# EAGLE design PUCY_E3_wzor (EAGLE 5.07)
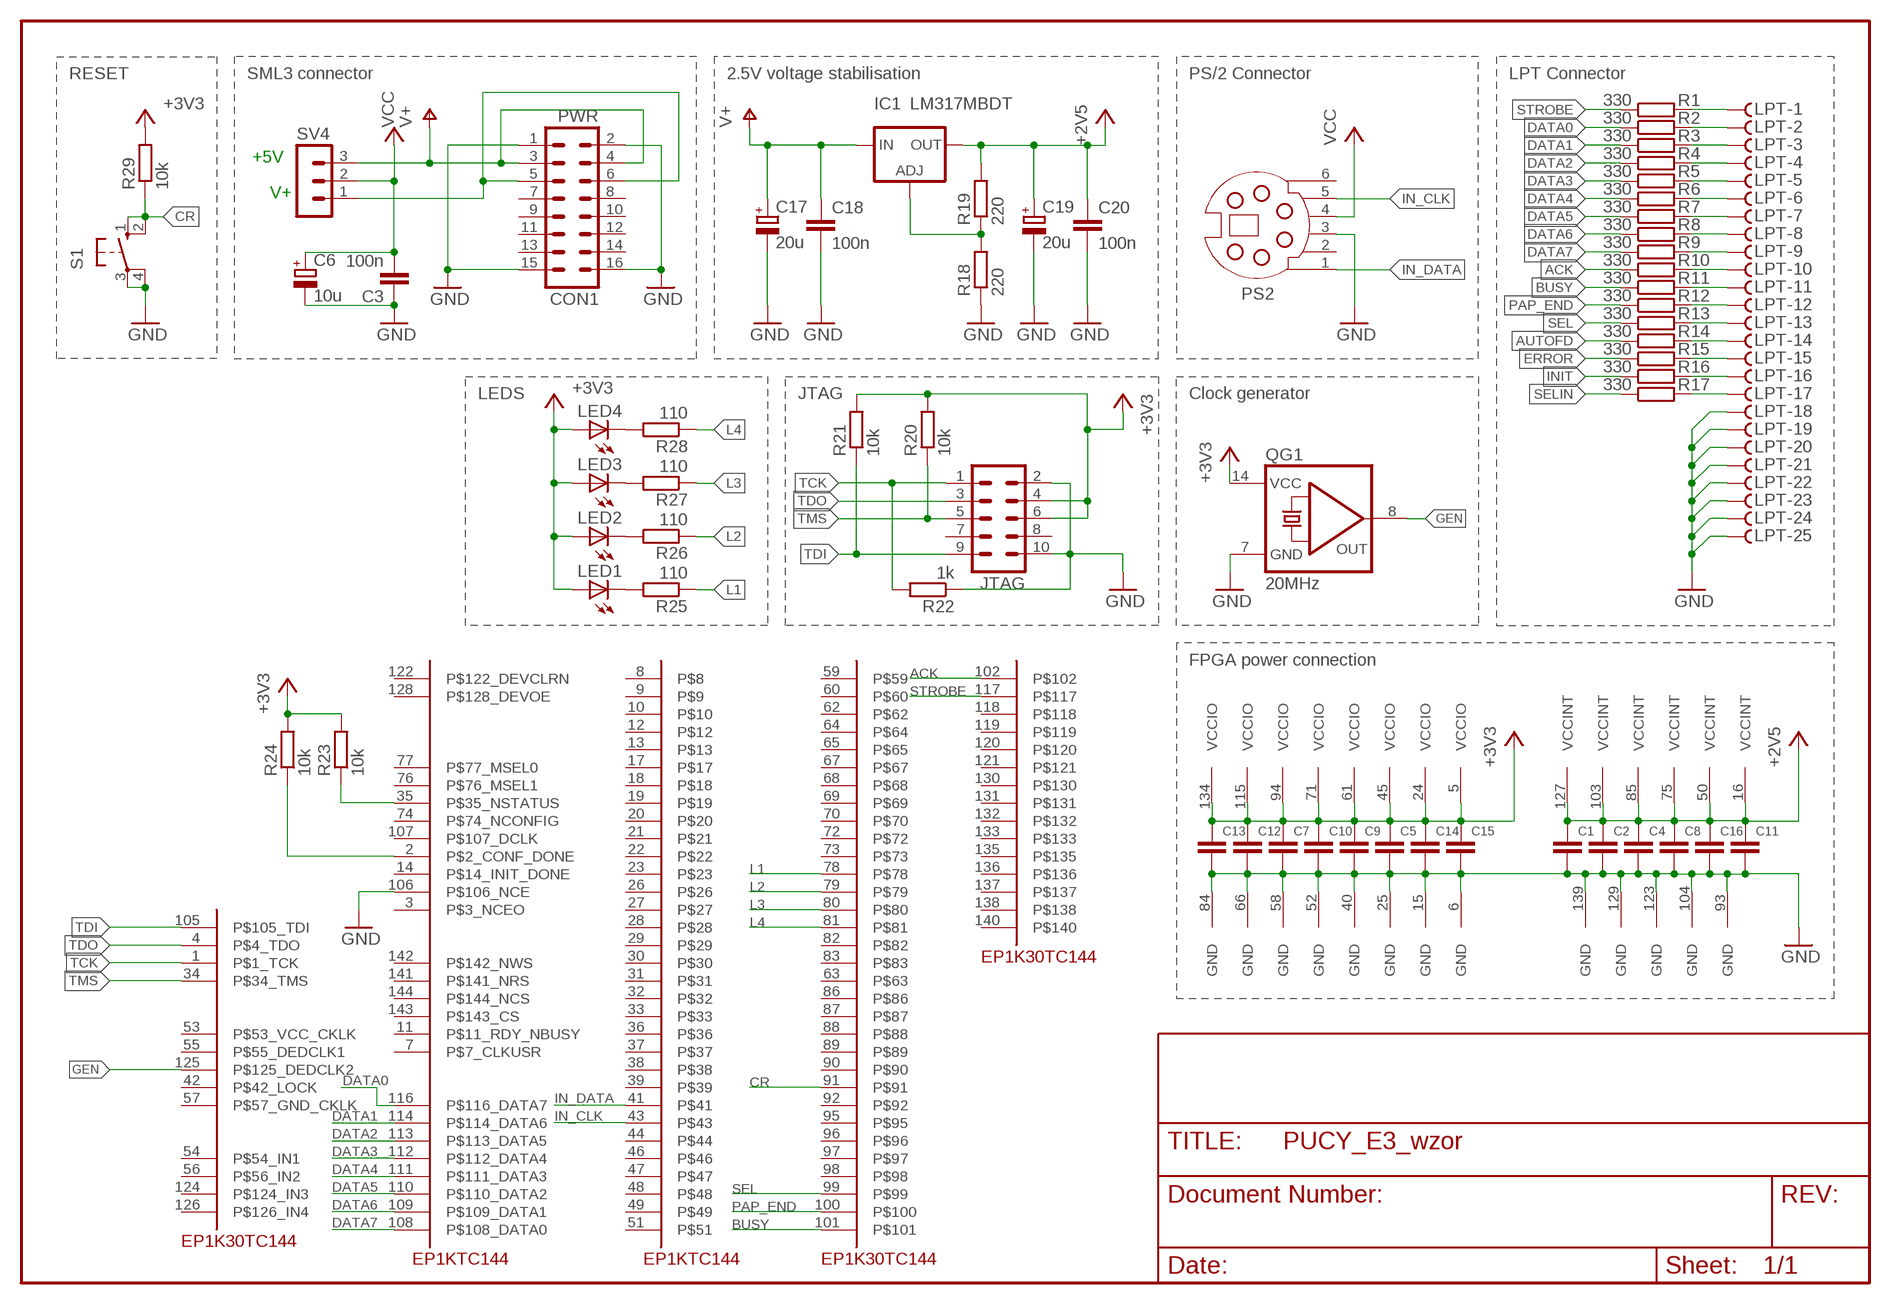
[diagram p0: schematic, sheet 1]

## Parts
C1  C-EUC0805  [C0805]
C2  C-EUC0805  [C0805]
C3  100n  C-EUC0805  [C0805]
C4  C-EUC0805  [C0805]
C5  C-EUC0805  [C0805]
C6  10u  CPOL-EUB/3528-21W  [B/3528-21W]
C7  C-EUC0805  [C0805]
C8  C-EUC0805  [C0805]
C9  C-EUC0805  [C0805]
C10  C-EUC0805  [C0805]
C11  C-EUC0805  [C0805]
C12  C-EUC0805  [C0805]
C13  C-EUC0805  [C0805]
C14  C-EUC0805  [C0805]
C15  C-EUC0805  [C0805]
C16  C-EUC0805  [C0805]
C17  20u  CPOL-EUB/3528-21W  [B/3528-21W]
C18  100n  C-EUC0805  [C0805]
C19  20u  CPOL-EUB/3528-21W  [B/3528-21W]
C20  100n  C-EUC0805  [C0805]
CON1  PWR  ML16  [ML16]
IC1  LM317MBDT  [DPACK]
JTAG  ML10  [ML10]
LED1  LEDCHIPLED_1206  [CHIPLED_1206]
LED2  LEDCHIPLED_1206  [CHIPLED_1206]
LED3  LEDCHIPLED_1206  [CHIPLED_1206]
LED4  LEDCHIPLED_1206  [CHIPLED_1206]
LPT  F25HPS  [F25HP]
PS2  MDSSV-BC06  [SSV-BC06]
QG1  20MHz  QG5860  [DIL14S]
R1  330  R-EU_R0805  [R0805]
R2  330  R-EU_R0805  [R0805]
R3  330  R-EU_R0805  [R0805]
R4  330  R-EU_R0805  [R0805]
R5  330  R-EU_R0805  [R0805]
R6  330  R-EU_R0805  [R0805]
R7  330  R-EU_R0805  [R0805]
R8  330  R-EU_R0805  [R0805]
R9  330  R-EU_R0805  [R0805]
R10  330  R-EU_R0805  [R0805]
R11  330  R-EU_R0805  [R0805]
R12  330  R-EU_R0805  [R0805]
R13  330  R-EU_R0805  [R0805]
R14  330  R-EU_R0805  [R0805]
R15  330  R-EU_R0805  [R0805]
R16  330  R-EU_R0805  [R0805]
R17  330  R-EU_R0805  [R0805]
R18  220  R-EU_R0805  [R0805]
R19  220  R-EU_R0805  [R0805]
R20  10k  R-EU_R0805  [R0805]
R21  10k  R-EU_R0805  [R0805]
R22  1k  R-EU_R0805  [R0805]
R23  10k  R-EU_R0805  [R0805]
R24  10k  R-EU_R0805  [R0805]
R25  110  R-EU_R0805  [R0805]
R26  110  R-EU_R0805  [R0805]
R27  110  R-EU_R0805  [R0805]
R28  110  R-EU_R0805  [R0805]
R29  10k  R-EU_R0805  [R0805]
S1  10-XX  [B3F-10XX]
SV4  MA03-1  [MA03-1]
U$1  PAWLA_EP1K30TC144  [PAWLA_TQFP144]

## Nets
+2V5: C1.1 C2.1 C4.1 C8.1 C11.1 C16.1 C19.+ C20.1 IC1.4(OUT) R19.2 U$1.16(VCCINT) U$1.50(VCCINT) U$1.75(VCCINT) U$1.85(VCCINT) U$1.103(VCCINT) U$1.127(VCCINT)
+3V3: C3.2 C5.1 C6.+ C7.1 C9.1 C10.1 C12.1 C13.1 C14.1 C15.1 JTAG.4 JTAG.6 LED1.A LED2.A LED3.A LED4.A PS2.4 QG1.14(VCC) R20.2 R21.2 R23.2 R24.2 R29.2 SV4.2 U$1.5(VCCIO) U$1.24(VCCIO) U$1.45(VCCIO) U$1.61(VCCIO) U$1.71(VCCIO) U$1.94(VCCIO) U$1.115(VCCIO) U$1.134(VCCIO) ; supply symbol labelled VCC
ACK: R10.1 U$1.102
ACK_L: LPT.10 R10.2
AUTOFD: R14.1
AUTOFD_L: LPT.14 R14.2
BUSY: R11.1 U$1.101
BUSY_L: LPT.11 R11.2
CR: R29.1 S1.1(S) S1.2(S1) U$1.91
DATA0: R2.1 U$1.116(P$116_DATA7)
DATA0_L: LPT.2 R2.2
DATA1: R3.1 U$1.114(P$114_DATA6)
DATA1_L: LPT.3 R3.2
DATA2: R4.1 U$1.113(P$113_DATA5)
DATA2_L: LPT.4 R4.2
DATA3: R5.1 U$1.112(P$112_DATA4)
DATA3_L: LPT.5 R5.2
DATA4: R6.1 U$1.111(P$111_DATA3)
DATA4_L: LPT.6 R6.2
DATA5: R7.1 U$1.110(P$110_DATA2)
DATA5_L: LPT.7 R7.2
DATA6: R8.1 U$1.109(P$109_DATA1)
DATA6_L: LPT.8 R8.2
DATA7: R9.1 U$1.108(P$108_DATA0)
DATA7_L: LPT.9 R9.2
ERROR: R15.1
ERROR_L: LPT.15 R15.2
GEN: QG1.8(OUT) U$1.125(P$125_DEDCLK2)
GND: C1.2 C2.2 C3.1 C4.2 C5.2 C6.- C7.2 C8.2 C9.2 C10.2 C11.2 C12.2 C13.2 C14.2 C15.2 C16.2 C17.- C18.2 C19.- C20.2 CON1.1 CON1.2 CON1.15 CON1.16 JTAG.2 JTAG.10 LPT.18 LPT.19 LPT.20 LPT.21 LPT.22 LPT.23 LPT.24 LPT.25 PS2.3 QG1.7(GND) R18.1 R22.1 S1.3(P) S1.4(P1) U$1.6(GND) U$1.15(GND) U$1.25(GND) U$1.40(GND) U$1.52(GND) U$1.58(GND) U$1.66(GND) U$1.84(GND) U$1.93(GND) U$1.104(GND) U$1.106(P$106_NCE) U$1.123(GND) U$1.129(GND) U$1.139(GND)
IN_CLK: PS2.5 U$1.43
IN_DATA: PS2.1 U$1.41
INIT: R16.1
INIT_L: LPT.16 R16.2
L1: R25.1 U$1.78
L2: R26.1 U$1.79
L3: R27.1 U$1.80
L4: R28.1 U$1.81
N$1: IC1.1(ADJ) R18.2 R19.1
N$2: R24.1 U$1.2(P$2_CONF_DONE)
N$3: R23.1 U$1.35(P$35_NSTATUS)
N$4: CON1.5 CON1.6 SV4.1
N$5: LED1.C R25.2
N$6: LED2.C R26.2
N$7: LED3.C R27.2
N$8: LED4.C R28.2
PAP_END: R12.1 U$1.100
PAP_END_L: LPT.12 R12.2
SEL: R13.1 U$1.99
SEL_L: LPT.13 R13.2
SELIN: R17.1
SELIN_L: LPT.17 R17.2
STROBE: R1.1 U$1.117
STROBE_L: LPT.1 R1.2
TCK: JTAG.1 R22.2 U$1.1(P$1_TCK)
TDI: JTAG.9 R21.1 U$1.105(P$105_TDI)
TDO: JTAG.3 U$1.4(P$4_TDO)
TMS: JTAG.5 R20.1 U$1.34(P$34_TMS)
V+: C17.+ C18.1 CON1.3 CON1.4 IC1.3(IN) SV4.3
Unconnected: CON1.7 CON1.8 CON1.9 CON1.10 CON1.11 CON1.12 CON1.13 CON1.14 JTAG.7 JTAG.8 PS2.2 PS2.6 U$1.3(P$3_NCEO) U$1.7(P$7_CLKUSR) U$1.8 U$1.9 U$1.10 U$1.11(P$11_RDY_NBUSY) U$1.12 U$1.13 U$1.14(P$14_INIT_DONE) U$1.17 U$1.18 U$1.19 U$1.20 U$1.21 U$1.22 U$1.23 U$1.26 U$1.27 U$1.28 U$1.29 U$1.30 U$1.31 U$1.32 U$1.33 U$1.36 U$1.37 U$1.38 U$1.39 U$1.42(P$42_LOCK) U$1.44 U$1.46 U$1.47 U$1.48 U$1.49 U$1.51 U$1.53(P$53_VCC_CKLK) U$1.54(P$54_IN1) U$1.55(P$55_DEDCLK1) U$1.56(P$56_IN2) U$1.57(P$57_GND_CKLK) U$1.59 U$1.60 U$1.62 U$1.63 U$1.64 U$1.65 U$1.67 U$1.68 U$1.69 U$1.70 U$1.72 U$1.73 U$1.74(P$74_NCONFIG) U$1.76(P$76_MSEL1) U$1.77(P$77_MSEL0) U$1.82 U$1.83 U$1.86 U$1.87 U$1.88 U$1.89 U$1.90 U$1.92 U$1.95 U$1.96 U$1.97 U$1.98 U$1.107(P$107_DCLK) U$1.118 U$1.119 U$1.120 U$1.121 U$1.122(P$122_DEVCLRN) U$1.124(P$124_IN3) U$1.126(P$126_IN4) U$1.128(P$128_DEVOE) U$1.130 U$1.131 U$1.132 U$1.133 U$1.135 U$1.136 U$1.137 U$1.138 U$1.140 U$1.141(P$141_NRS) U$1.142(P$142_NWS) U$1.143(P$143_CS) U$1.144(P$144_NCS)

## Notes on the sheet
- RESET | SML3 connector | 2.5V voltage stabilisation | PS/2 Connector | LPT Connector
- +5V
- V+
- LEDS | JTAG | Clock generator
- FPGA power connection

## Library data of the parts
C1 C2 C4 C5 C7-C16 C18 C20 = resistor:C-EU: CAPACITOR, European symbol
C3 = rcl:C-EU: CAPACITOR, European symbol
C6 C17 C19 = rcl:CPOL-EU: POLARIZED CAPACITOR, European symbol
CON1 = con-ml:ML16: HARTING
IC1 = v-reg:LM317?*: 500 mA Adjustable Output Positive Voltage Regulator Source: http://www.onsemi.co.jp .. LM317M-D.PDF
JTAG = con-ml:ML10: HARTING
LED1-LED4 = led:LED: LED OSRAM: - CHIPLED LG R971, LG N971, LY N971, LG Q971, LY Q971, LO R971, LY R971 LH N974, LH R974 LS Q976, LO Q976, LY Q976 LO Q996 - Hyper CHIPLED LW Q18S LB Q993, LB Q99A, LB R99A - SideLED LS A670, LO A670, LY A670, LG A670, LP A670 LB A673, LV A673, LT A673, LW A673 LH A674 LY A675 LS A676, LA A676, LO A676, LY A676, LW A676 LS A679, LY A679, LG A679 - Hyper Micro SIDELED® LS Y876, LA Y876, LO Y876, LY Y876 LT Y87S - SmartLED LW L88C, LW L88S LB L89C, LB L89S, LG L890 LS L89K, LO L89K, LY L89K LS L896, LA L896, LO L896, LY L896 - TOPLED LS T670, LO T670, LY T670, LG T670, LP T670 LSG T670, LSP T670, LSY T670, LOP T670, LYG T670 LG T671, LOG T671, LSG T671 LB T673, LV T673, LT T673, LW T673 LH T674 LS T676, LA T676, LO T676, LY T676, LB T676, LH T676, LSB T676, LW T676 LB T67C, LV T67C, LT T67C, LS T67K, LO T67K, LY T67K, LW E67C LS E67B, LA E67B, LO E67B, LY E67B, LB E67C, LV E67C, LT E67C LW T67C LS T679, LY T679, LG T679 LS T770, LO T770, LY T770, LG T770, LP T770 LB T773, LV T773, LT T773, LW T773 LH T774 LS E675, LA E675, LY E675, LS T675 LS T776, LA T776, LO T776, LY T776, LB T776 LHGB T686 LT T68C, LB T68C - Hyper Mini TOPLED® LB M676 - Mini TOPLED Santana® LG M470 LS M47K, LO M47K, LY M47K Source: http://www.osram.convergy.de LUXEON: - LUMILED® LXK2-PW12-R00, LXK2-PW12-S00, LXK2-PW14-U00, LXK2-PW14-V00 LXK2-PM12-R00, LXK2-PM12-S00, LXK2-PM14-U00 LXK2-PE12-Q00, LXK2-PE12-R00, LXK2-PE12-S00, LXK2-PE14-T00, LXK2-PE14-U00 LXK2-PB12-K00, LXK2-PB12-L00, LXK2-PB12-M00, LXK2-PB14-N00, LXK2-PB14-P00, LXK2-PB14-Q00 LXK2-PR12-L00, LXK2-PR12-M00, LXK2-PR14-Q00, LXK2-PR14-R00 LXK2-PD12-Q00, LXK2-PD12-R00, LXK2-PD12-S00 LXK2-PH12-R00, LXK2-PH12-S00 LXK2-PL12-P00, LXK2-PL12-Q00, LXK2-PL12-R00 Source: www.luxeon.com KINGBRIGHT: KA-3528ASYC Source: www.kingbright.com
LPT = con-subd:F25?S: SUB-D
PS2 = con-yamaichi:MDSSV-BC06: YAMAICHI CONNECTOR
QG1 = crystal:QG5860: CRYSTAL RESONATOR
R1-R29 = rcl:R-EU_: RESISTOR, European symbol
S1 = switch-omron:10-XX: OMRON SWITCH
SV4 = con-lstb:MA03-1: PIN HEADER
U$1 = EP1K30TC144:PAWLA_EP1K30TC144

## Board
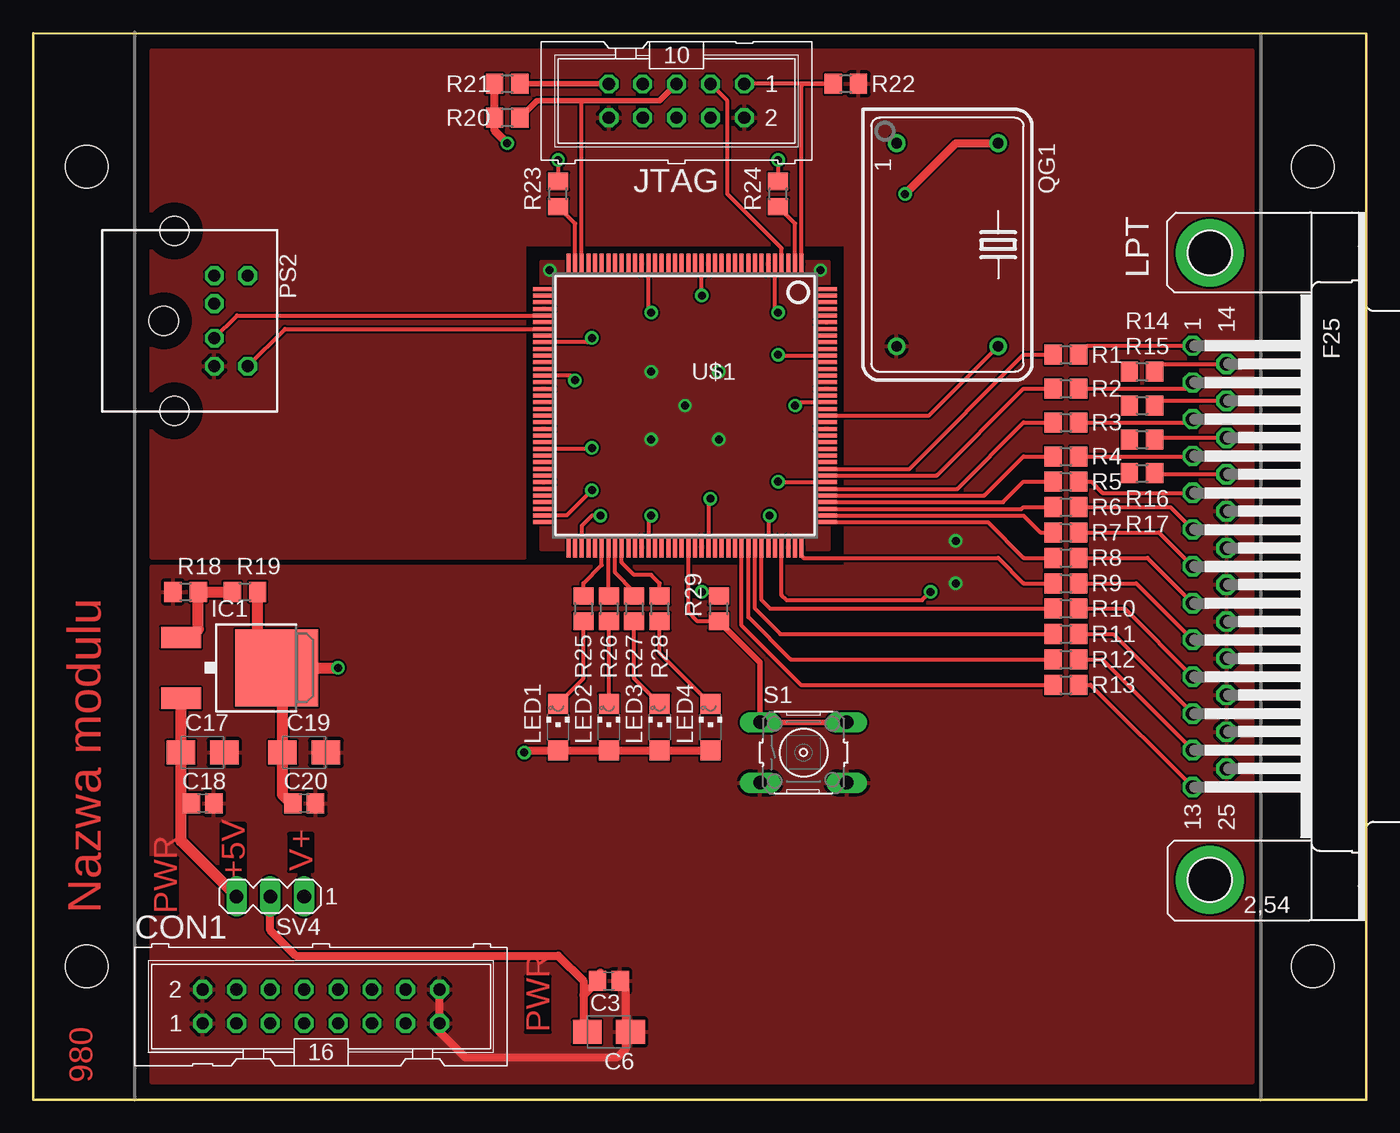
[diagram p1: board, top side]
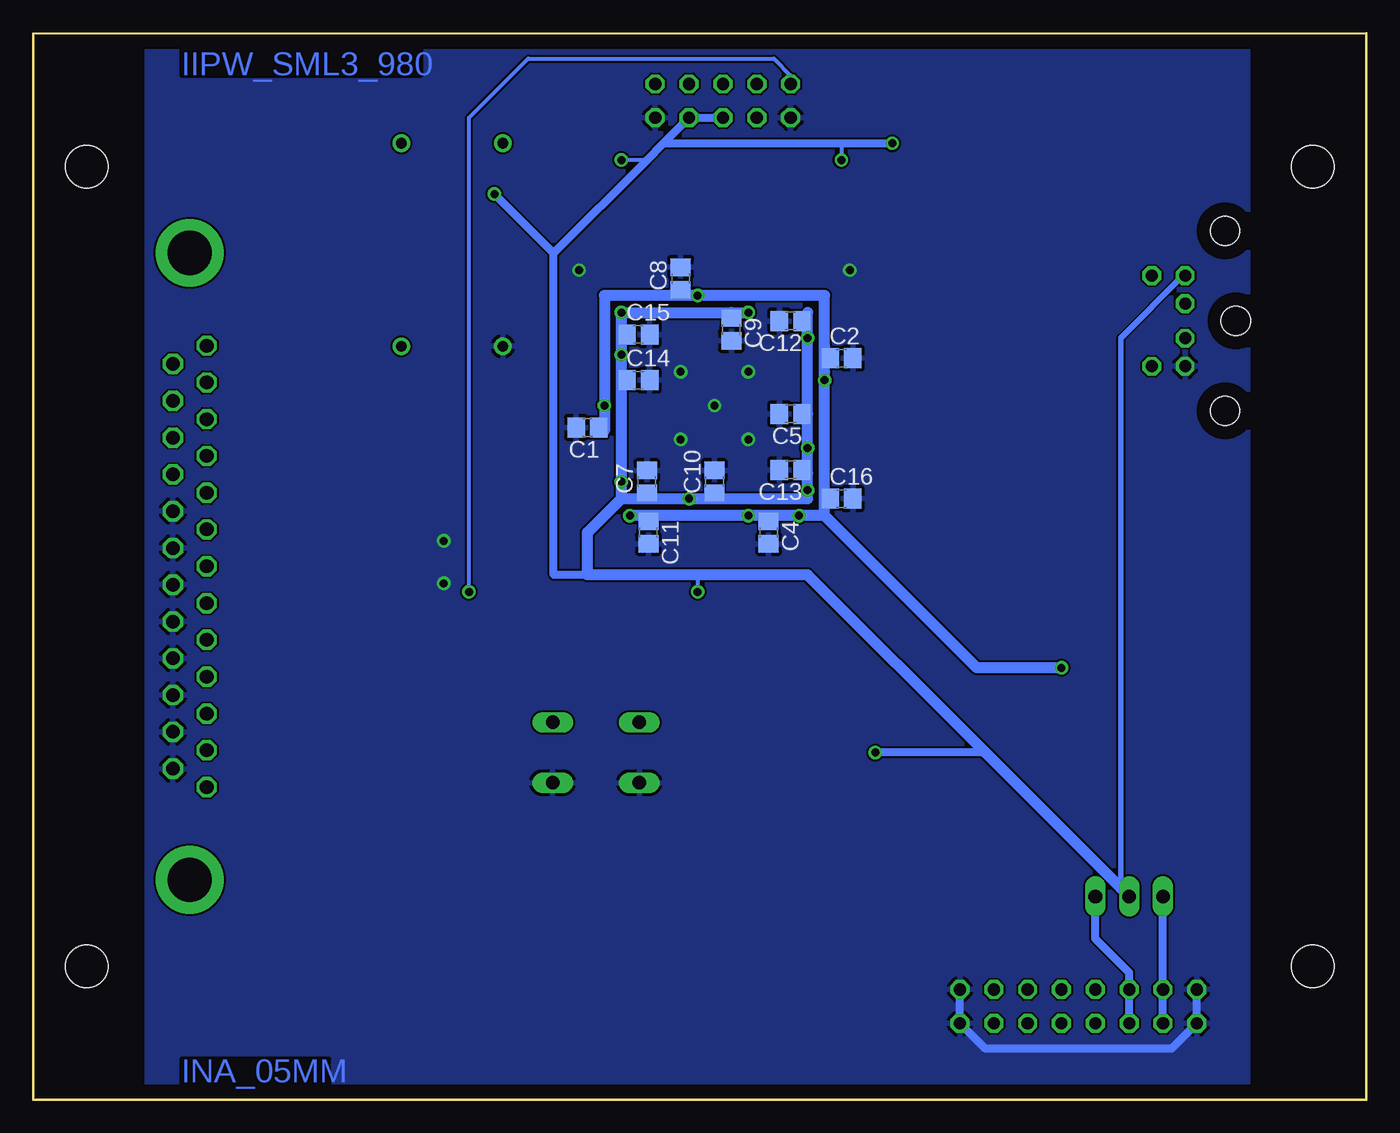
[diagram p2: board, bottom side, seen from below]

Size 100 x 80 mm. Coordinates in mm from the lower left corner, seen from the top.
Outline: 0,0 100,0 100,79.98 0,80 0,0
Copper layers (1*16): Top 0.035mm / dielectric 1.5mm / Bottom 0.035mm
Design rules "default *": minimum track width 8mil, minimum drill 12mil, track to track 6mil, track to pad 6mil, pad to pad 6mil, via to via 6mil, smd to smd 6mil, copper to edge 40mil, drill to drill 8mil, minimum pad ring 10mil, minimum via ring 8mil, stop-mask expansion 4mil, vias tented up to drill 0mil, thermal gap 10mil
Holes 3.2 mm at 4,10 4,70 96,10 96,70

### Footprints (pad centres in the part's own frame; a part is rotated, then mirrored left to right if it is on the bottom)
C0805 = smd 1.3 x 1.5: 1 -0.85,0; 2 0.85,0
B/3528-21W = smd 2.15 x 1.8: + 1.625,0; - -1.625,0
ML16 = drill 0.914 octagon: 1 -8.89,-1.27; 2 -8.89,1.27; 3 -6.35,-1.27; 4 -6.35,1.27; 5 -3.81,-1.27; 6 -3.81,1.27; 7 -1.27,-1.27; 8 -1.27,1.27; 9 1.27,-1.27; 10 1.27,1.27; 11 3.81,-1.27; 12 3.81,1.27; 13 6.35,-1.27; 14 6.35,1.27; 15 8.89,-1.27; 16 8.89,1.27
DPACK = smd 1.6 x 3: 1 -2.28,-4.8; 3 2.28,-4.8 | smd 5.8 x 6.2: 4 0,2.38
ML10 = drill 0.914 octagon: 1 -5.08,-1.27; 2 -5.08,1.27; 3 -2.54,-1.27; 4 -2.54,1.27; 5 0,-1.27; 6 0,1.27; 7 2.54,-1.27; 8 2.54,1.27; 9 5.08,-1.27; 10 5.08,1.27
CHIPLED_1206 = smd 1.5 x 1.5: A 0,-1.75; C 0,1.75
F25HP = drill 1.016 octagon: 1 -16.561,-1.27; 2 -13.792,-1.27; 3 -11.049,-1.27; 4 -8.28,-1.27; 5 -5.512,-1.27; 6 -2.769,-1.27; 7 0,-1.27; 8 2.769,-1.27; 9 5.512,-1.27; 10 8.28,-1.27; 11 11.049,-1.27; 12 13.792,-1.27; 13 16.561,-1.27; 14 -15.189,1.27; 15 -12.421,1.27; 16 -9.652,1.27; 17 -6.909,1.27; 18 -4.14,1.27; 19 -1.372,1.27; 20 1.372,1.27; 21 4.14,1.27; 22 6.909,1.27; 23 9.652,1.27; 24 12.421,1.27; 25 15.189,1.27 | drill 3.302 pad 5.08 round: G1 -23.52,0; G2 23.52,0
SSV-BC06 = drill 0.9 octagon: 1 1.3,8.5; 2 -1.3,8.5; 3 3.4,8.5; 4 -3.4,8.5; 5 3.4,11; 6 -3.4,11 | hole 2.2: -6.75,5.5; 0,4.7; 6.75,5.5
DIL14S = drill 0.813 round: 1 -7.62,-3.81; 7 7.62,-3.81; 8 7.62,3.81; 14 -7.62,3.81
R0805 = smd 1.3 x 1.5: 1 -0.95,0; 2 0.95,0
B3F-10XX = drill 1.016 long: 1 -3.251,2.261; 2 3.251,2.261; 3 -3.251,-2.261; 4 3.251,-2.261
MA03-1 = drill 1.016 long: 1 -2.54,0; 2 0,0; 3 2.54,0
PAWLA_TQFP144 = smd 0.3 x 1.6: 1 -8.75,-10.6; 2 -8.25,-10.6; 3 -7.75,-10.6; 4 -7.25,-10.6; 5 -6.75,-10.6; 6 -6.25,-10.6; 7 -5.75,-10.6; 8 -5.25,-10.6; 9 -4.75,-10.6; 10 -4.25,-10.6; 11 -3.75,-10.6; 12 -3.25,-10.6; 13 -2.75,-10.6; 14 -2.25,-10.6; 15 -1.75,-10.6; 16 -1.25,-10.6; 17 -0.75,-10.6; 18 -0.25,-10.6; 19 0.25,-10.6; 20 0.75,-10.6; 21 1.25,-10.6; 22 1.75,-10.6; 23 2.25,-10.6; 24 2.75,-10.6; 25 3.25,-10.6; 26 3.75,-10.6; 27 4.25,-10.6; 28 4.75,-10.6; 29 5.25,-10.6; 30 5.75,-10.6; 31 6.25,-10.6; 32 6.75,-10.6; 33 7.25,-10.6; 34 7.75,-10.6; 35 8.25,-10.6; 36 8.75,-10.6; 73 8.75,10.6; 74 8.25,10.6; 75 7.75,10.6; 76 7.25,10.6; 77 6.75,10.6; 78 6.25,10.6; 79 5.75,10.6; 80 5.25,10.6; 81 4.75,10.6; 82 4.25,10.6; 83 3.75,10.6; 84 3.25,10.6; 85 2.75,10.6; 86 2.25,10.6; 87 1.75,10.6; 88 1.25,10.6; 89 0.75,10.6; 90 0.25,10.6; 91 -0.25,10.6; 92 -0.75,10.6; 93 -1.25,10.6; 94 -1.75,10.6; 95 -2.25,10.6; 96 -2.75,10.6; 97 -3.25,10.6; 98 -3.75,10.6; 99 -4.25,10.6; 100 -4.75,10.6; 101 -5.25,10.6; 102 -5.75,10.6; 103 -6.25,10.6; 104 -6.75,10.6; 105 -7.25,10.6; 106 -7.75,10.6; 107 -8.25,10.6; 108 -8.75,10.6 | smd 1.6 x 0.3: 37 10.6,-8.75; 38 10.6,-8.25; 39 10.6,-7.75; 40 10.6,-7.25; 41 10.6,-6.75; 42 10.6,-6.25; 43 10.6,-5.75; 44 10.6,-5.25; 45 10.6,-4.75; 46 10.6,-4.25; 47 10.6,-3.75; 48 10.6,-3.25; 49 10.6,-2.75; 50 10.6,-2.25; 51 10.6,-1.75; 52 10.6,-1.25; 53 10.6,-0.75; 54 10.6,-0.25; 55 10.6,0.25; 56 10.6,0.75; 57 10.6,1.25; 58 10.6,1.75; 59 10.6,2.25; 60 10.6,2.75; 61 10.6,3.25; 62 10.6,3.75; 63 10.6,4.25; 64 10.6,4.75; 65 10.6,5.25; 66 10.6,5.75; 67 10.6,6.25; 68 10.6,6.75; 69 10.6,7.25; 70 10.6,7.75; 71 10.6,8.25; 72 10.6,8.75; 109 -10.6,8.75; 110 -10.6,8.25; 111 -10.6,7.75; 112 -10.6,7.25; 113 -10.6,6.75; 114 -10.6,6.25; 115 -10.6,5.75; 116 -10.6,5.25; 117 -10.6,4.75; 118 -10.6,4.25; 119 -10.6,3.75; 120 -10.6,3.25; 121 -10.6,2.75; 122 -10.6,2.25; 123 -10.6,1.75; 124 -10.6,1.25; 125 -10.6,0.75; 126 -10.6,0.25; 127 -10.6,-0.25; 128 -10.6,-0.75; 129 -10.6,-1.25; 130 -10.6,-1.75; 131 -10.6,-2.25; 132 -10.6,-2.75; 133 -10.6,-3.25; 134 -10.6,-3.75; 135 -10.6,-4.25; 136 -10.6,-4.75; 137 -10.6,-5.25; 138 -10.6,-5.75; 139 -10.6,-6.25; 140 -10.6,-6.75; 141 -10.6,-7.25; 142 -10.6,-7.75; 143 -10.6,-8.25; 144 -10.6,-8.75

### Placement (x,y rotation side)
C1  58.42,50.42 180 bottom
C2  39.37,55.63 0 bottom
C3  43.18,8.89 180 top
C4  44.83,42.55 270 bottom
C5  43.18,51.44 180 bottom
C6  43.18,5.08 180 top
C7  53.98,46.35 90 bottom
C8  51.44,61.59 90 bottom
C9  47.62,57.78 270 bottom
C10  48.9,46.35 90 bottom
C11  53.85,42.55 270 bottom
C12  43.18,58.42 180 bottom
C13  43.18,47.24 180 bottom
C14  54.61,53.98 0 bottom
C15  54.61,57.4 0 bottom
C16  39.37,45.09 0 bottom
C17  12.7,26.04 180 top
C18  12.7,22.23 0 top
C19  20.32,26.04 180 top
C20  20.32,22.23 0 top
CON1  21.59,6.99 0 top
IC1  15.88,32.38 270 top
JTAG  48.26,74.93 180 top
LED1  39.37,27.94 0 top
LED2  43.18,27.94 0 top
LED3  46.99,27.94 0 top
LED4  50.8,27.94 0 top
LPT  88.27,40.01 270 top
PS2  5.08,58.42 270 top
QG1  68.58,64.14 270 top
R1  77.47,55.88 0 top
R2  77.47,53.34 0 top
R3  77.47,50.8 0 top
R4  77.47,48.26 0 top
R5  77.47,46.35 0 top
R6  77.47,44.45 0 top
R7  77.47,42.55 0 top
R8  77.47,40.64 0 top
R9  77.47,38.73 0 top
R10  77.47,36.83 0 top
R11  77.47,34.92 0 top
R12  77.47,33.02 0 top
R13  77.47,31.11 0 top
R14  83.19,54.61 0 top
R15  83.19,52.07 0 top
R16  83.19,49.53 0 top
R17  83.19,46.99 0 top
R18  11.43,38.1 0 top
R19  15.88,38.1 0 top
R20  35.56,73.66 180 top
R21  35.56,76.2 180 top
R22  60.96,76.2 180 top
R23  39.37,67.94 90 top
R24  55.88,67.94 90 top
R25  41.27,36.83 270 top
R26  43.18,36.83 270 top
R27  45.09,36.83 270 top
R28  46.99,36.83 270 top
R29  51.44,36.83 90 top
S1  57.78,26.04 0 top
SV4  17.78,15.24 180 top
U$1  48.9,52.07 180 top

### Tracks (layer width: path | path; a pad name or v marks a point on that pad's centre or on a via)
+2V5  (via drill 0.6)
  Top 0.305: U$1.50 40.3,54.32 v40.64,53.98 | U$1.16 50.15,60.34 v50.16,60.33 | U$1.75 41.15,43.05 41.91,43.81 v42.55,43.81 | U$1.85 46.15,43.6 v46.35,43.81 | U$1.103 55.15,43.72 v55.24,43.81 | U$1.127 57.4,52.32 v57.15,52.07
  Top 0.813: R19.2 16.82,33.02 17.3,32.54 | 17.3,32.54 17.46,32.38 IC1.4 | 18.63,31.97 18.7,31.91 C19.+ 18.7,22.86 19.33,22.23 C20.1 | 18.63,31.97 18.06,32.54 17.3,32.54 | v22.86,32.38 19.05,32.38 18.63,31.97
  Bottom 0.406: 44.2,43.81 C4.1 | C11.1 53.85,43.69 v55.24,43.81 | C1.1 57.32,50.8 v57.15,52.07 | 40.64,54.61 40.47,54.61 | 51.44,60.33 C8.1 | C2.1 40.47,56.52 40.64,56.52 | 40.64,45.09 C16.1
  Bottom 0.813: 40.64,43.81 40.64,45.09 v40.64,53.98 40.64,54.61 40.64,56.52 40.64,60.33 v50.16,60.33 51.44,60.33 57.15,60.33 v57.15,52.07 57.15,50.16 | v55.24,43.81 v46.35,43.81 44.2,43.81 v42.55,43.81 40.64,43.81 | 40.64,43.81 29.21,32.38 v22.86,32.38
+3V3  (via drill 0.6)
  Top 0.305: U$1.45 41.58,56.82 v41.91,57.15 | U$1.61 41.84,48.82 v41.91,48.9 | U$1.24 46.15,59.27 v46.35,59.05 | U$1.71 40.01,43.82 v41.91,45.72 | U$1.94 50.65,44.93 v50.8,45.09 | U$1.115 55.91,46.32 v55.88,46.35 | U$1.134 55.94,55.82 v55.88,55.88 | U$1.5 55.65,59.29 v55.88,59.05 | v39.37,70.48 R23.2 | v55.88,70.48 R24.2 | R29.2 51.12,38.1 v50.16,38.1
  Top 0.61: 42.55,9.53 42.55,8.89 C3.2 41.27,7.83 | C6.+ 41.27,5.08 41.27,7.83 | 41.27,7.83 41.27,8.89 39.37,10.79 19.68,10.79 17.78,12.7 SV4.2 | R21.2 R20.2 34.61,72.7 v35.56,71.75 | v65.41,67.94 69.22,71.75 QG1.14 | LED4.A LED3.A LED2.A LED1.A 36.98,26.19 v36.83,26.04
  Bottom 0.305: 39.37,71.75 v39.37,70.48 | 53.98,70.48 v55.88,70.48 | 50.16,39.37 v50.16,38.1
  Bottom 0.406: 55.88,53.98 C14.1 | C15.1 55.46,57.15 55.88,57.15 | 53.98,45.09 C7.1 | 48.9,45.09 C10.1 | 41.91,51.44 C5.1 | C13.1 42.33,46.99 41.91,46.99 | 41.91,59.05 C12.1 | 47.62,59.05 C9.1 | PS2.4 13.74,61.82 18.41,57.15 18.41,15.88
  Bottom 0.61: 58.42,39.37 60.96,39.37 60.96,63.5 | 60.96,63.5 53.98,70.48 52.7,71.75 | 52.7,71.75 JTAG.4 JTAG.6 | 52.7,71.75 39.37,71.75 v35.56,71.75 | 60.96,63.5 v65.41,67.94 | 28.57,26.04 v36.83,26.04
  Bottom 0.813: 41.91,59.05 v41.91,57.15 41.91,51.44 v41.91,48.9 41.91,46.99 v41.91,45.72 41.91,45.09 48.9,45.09 v50.8,45.09 53.98,45.09 55.88,45.09 | 55.88,45.09 v55.88,46.35 55.88,53.98 v55.88,55.88 55.88,57.15 v55.88,59.05 47.62,59.05 v46.35,59.05 | SV4.2 18.41,15.88 28.57,26.04 41.91,39.37 50.16,39.37 58.42,39.37 58.42,42.55 55.88,45.09
ACK
  Top 0.305: R10.1 55.28,36.83 54.65,37.47 U$1.102
ACK_L
  Top 0.305: R10.2 81.89,36.83 LPT.10
AUTOFD_L
  Top 0.305: LPT.14 84.72,55.19 R14.2
BUSY
  Top 0.305: R11.1 56.05,34.92 54.15,36.83 U$1.101
BUSY_L
  Top 0.305: R11.2 81.03,34.92 LPT.11
CR
  Top 0.305: U$1.91 49.15,36.58 49.84,35.88 R29.1
  Top 0.406: R29.1 54.53,32.78 S1.1 S1.2
DATA0
  Top 0.305: U$1.116 67.78,46.82 74.3,53.34 R2.1
DATA0_L
  Top 0.305: R2.2 86.54,53.34 LPT.2
DATA1
  Top 0.305: U$1.114 69.31,45.82 74.3,50.8 R3.1
DATA1_L
  Top 0.305: R3.2 86.74,50.8 LPT.3
DATA2
  Top 0.305: U$1.113 71.36,45.32 74.3,48.26 R4.1
DATA2_L
  Top 0.305: R4.2 86.97,48.26 LPT.4
DATA3
  Top 0.305: U$1.112 72.76,44.82 74.3,46.35 R5.1
DATA3_L
  Top 0.305: LPT.5 80.21,45.52 79.38,46.35 R5.2
DATA4
  Top 0.305: U$1.111 74.17,44.32 74.3,44.45 R6.1
DATA4_L
  Top 0.305: R6.2 85.32,44.45 LPT.6
DATA5
  Top 0.305: R7.1 75.56,42.55 74.3,43.81 U$1.110
DATA5_L
  Top 0.305: R7.2 84.45,42.55 LPT.7
DATA6
  Top 0.305: U$1.109 71.61,43.32 74.3,40.64 R8.1
DATA6_L
  Top 0.305: R8.2 83.59,40.64 LPT.8
DATA7
  Top 0.305: U$1.108 57.65,40.78 57.78,40.64 72.39,40.64 74.3,38.73 R9.1
DATA7_L
  Top 0.305: R9.2 82.75,38.73 LPT.9
ERROR_L
  Top 0.305: LPT.15 84.49,52.43 R15.2
GEN
  Top 0.305: QG1.8 67.19,51.32 U$1.125
GND  (via drill 0.6)
  Top 0.61: CON1.16 CON1.15 30.48,5.08 32.38,3.17 43.81,3.17 44.45,3.81 44.45,5.08 | 44.45,5.08 C6.- | C3.1 43.81,8.89 44.45,8.26 44.45,5.08
  Bottom 0.61: CON1.16 CON1.15 28.57,3.81 14.61,3.81 CON1.1 CON1.2
  other vias: 48.9,52.07 46.35,49.53 46.35,54.61 51.44,54.61 51.44,49.53 38.73,62.23 59.05,62.23 69.22,41.91 69.22,38.73
  pour Bottom: 8.89,78.74 91.44,78.74 91.44,1.27 8.89,1.27
  pour Top: 38.1,41.27 38.1,62.87 59.69,62.87 59.69,41.27
  pour Top: 8.89,78.74 91.44,78.74 91.44,1.27 8.89,1.27 8.89,40.01 60.96,40.01 60.96,64.14 36.83,64.14 36.83,40.64 8.89,40.64
IN_CLK
  Top 0.305: U$1.43 18.88,57.82 PS2.5
IN_DATA
  Top 0.305: U$1.41 15.28,58.82 PS2.1
INIT_L
  Top 0.305: LPT.16 84.26,49.66 R16.2
L1
  Top 0.305: U$1.78 42.65,40.1 41.27,38.73 R25.1
L2
  Top 0.305: U$1.79 43.15,37.81 R26.1
L3
  Top 0.305: U$1.80 43.65,39.54 45.09,38.1 R27.1
L4
  Top 0.305: U$1.81 44.15,40.31 45.09,39.37 46.35,39.37 46.99,38.73 R28.1
N$1
  Top 0.813: 11.12,34.7 IC1.1 11.74,34.66 12.38,35.3 R18.2 R19.1
N$2
  Top 0.305: U$1.2 57.15,65.73 R24.1
N$3
  Top 0.305: U$1.35 40.65,65.72 R23.1
N$4
  Bottom 0.61: CON1.5 CON1.6 17.78,9.53 20.32,12.06 SV4.1
N$5
  Top 0.305: R25.2 41.27,31.59 LED1.C
N$6
  Top 0.305: LED2.C R26.2
N$7
  Top 0.305: R27.2 45.09,31.59 LED3.C
N$8
  Top 0.305: R28.2 46.99,33.5 LED4.C
PAP_END
  Top 0.305: R12.1 56.82,33.02 53.65,36.2 U$1.100
PAP_END_L
  Top 0.305: R12.2 80.19,33.02 LPT.12
SEL
  Top 0.305: R13.1 57.59,31.11 53.15,35.56 U$1.99
SEL_L
  Top 0.305: R13.2 79.32,31.11 LPT.13
SELIN_L
  Top 0.305: LPT.17 84.21,46.91 R17.2
STROBE
  Top 0.305: U$1.117 65.73,47.32 74.3,55.88 R1.1
STROBE_L
  Top 0.305: LPT.1 79.11,56.57 R1.2
TCK
  Top 0.305: U$1.1 57.65,76.06 57.78,76.2 R22.2 JTAG.1
TDI  (via drill 0.6)
  Top 0.305: U$1.105 56.15,37.84 56.52,37.47 66.67,37.47 v67.31,38.1
  Top 0.406: JTAG.9 R21.1
  Bottom 0.305: v67.31,38.1 67.31,73.66 62.87,78.11 44.45,78.11 43.18,76.83 JTAG.9
TDO
  Top 0.305: JTAG.3 52.07,74.93 52.07,67.94 56.15,63.87 U$1.4
TMS
  Top 0.305: U$1.34 41.15,74.8 41.27,74.93
  Top 0.406: JTAG.5 46.99,74.93 41.27,74.93 37.78,74.93 R20.1
V+
  Top 0.813: SV4.3 11.07,19.41 11.07,22.23 | 11.07,22.23 C17.+ IC1.3 | 11.07,22.23 C18.1
  Bottom 0.61: CON1.3 CON1.4 SV4.3

### Text on the board
Top: +5V | V+ | Nazwa modulu | PWR | PWR | 980
Bottom: IIPW_SML3_980 | INA_05MM